# EAGLE design AMP 1.0 (EAGLE 6.5.0)
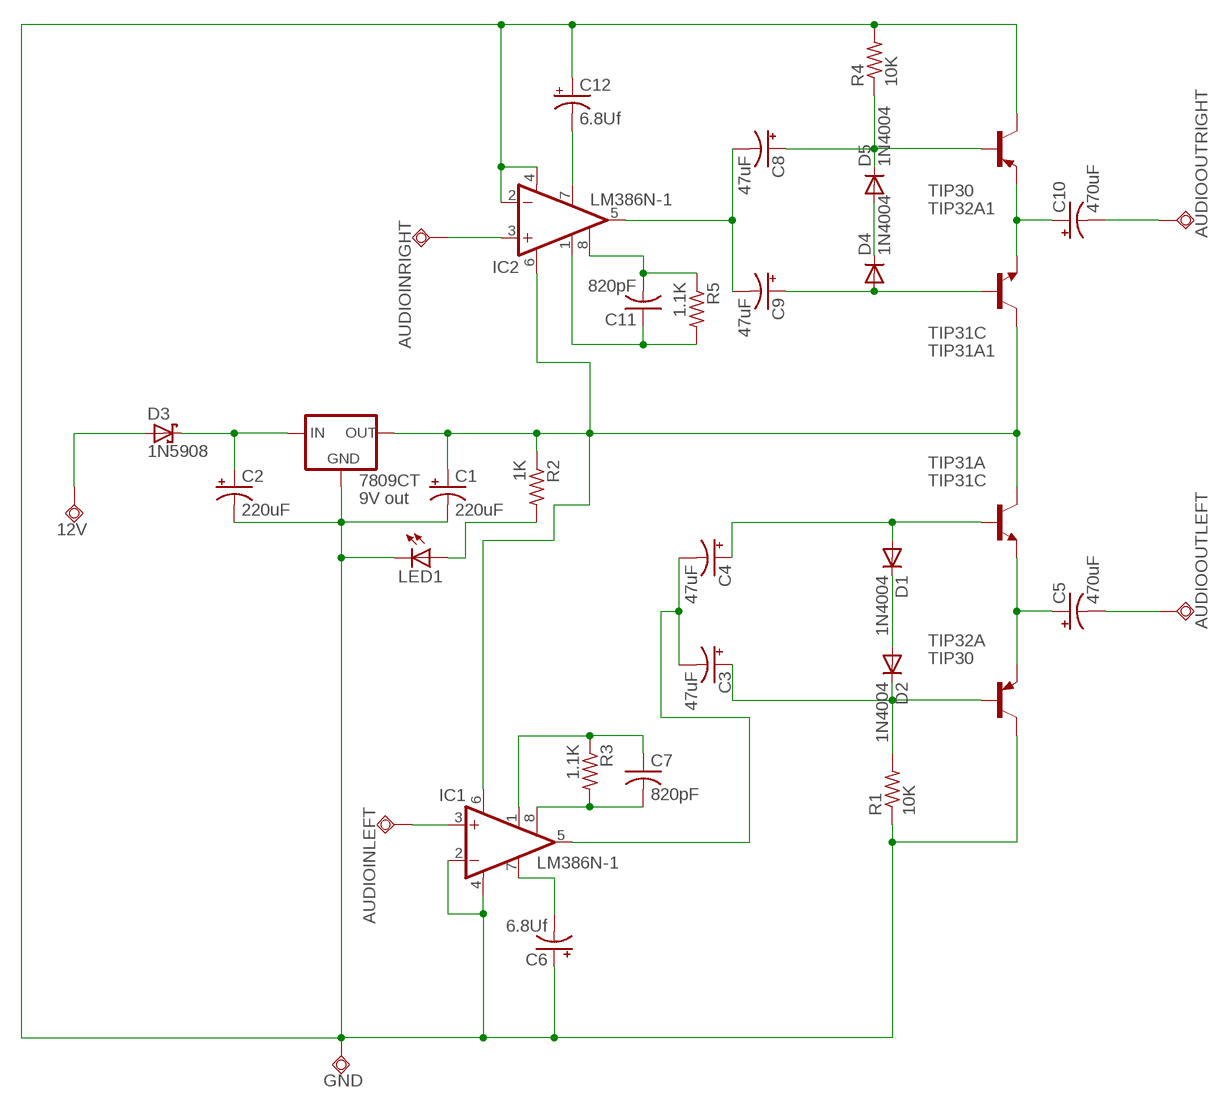
[diagram p0: schematic, sheet 1]

## Parts
12V  TPSQPAD1-20  [P1-20]
7809CT  9V out  78XXL  [78XXL]
AUDIOINLEFT  TPSQPAD1-20  [P1-20]
AUDIOINRIGHT  TPSQPAD1-20  [P1-20]
AUDIOOUTLEFT  TPSQPAD1-20  [P1-20]
AUDIOOUTRIGHT  TPSQPAD1-20  [P1-20]
C1  220uF  CPOL-USB45181C  [B45181C]
C2  220uF  CPOL-USB45181C  [B45181C]
C3  47uF  CPOL-USE5-4  [E5-4]
C4  47uF  CPOL-USE5-4  [E5-4]
C5  470uF  CPOL-USE5-4  [E5-4]
C6  6.8Uf  CPOL-USE5-4  [E5-4]
C7  820pF  C-US050-050X075  [C050-050X075]
C8  47uF  CPOL-USE5-4  [E5-4]
C9  47uF  CPOL-USE5-4  [E5-4]
C10  470uF  CPOL-USE5-4  [E5-4]
C11  820pF  C-US050-050X075  [C050-050X075]
C12  6.8Uf  CPOL-USE5-4  [E5-4]
D1  1N4004  [DO41-10]
D2  1N4004  [DO41-10]
D3  1N5908  [C4111-15]
D4  1N4004  [DO41-10]
D5  1N4004  [DO41-10]
GND  TPSQPAD1-20  [P1-20]
IC1  LM386N-1  [DIL08]
IC2  LM386N-1  [DIL08]
LED1  LED5MM  [LED5MM]
R1  10K  R-US_0204/7  [0204/7]
R2  1K  R-US_0204/7  [0204/7]
R3  1.1K  R-US_0204/7  [0204/7]
R4  10K  R-US_0204/7  [0204/7]
R5  1.1K  R-US_0204/7  [0204/7]
TIP31A  TIP31C  [TO220]
TIP31A1  TIP31C  [TO220]
TIP32A  TIP30  [TO220]
TIP32A1  TIP30  [TO220]

## Nets
N$1: D1.C D2.A
N$2: C3.+ D2.C R1.2 TIP32A.1(B)
N$3: C4.+ D1.A TIP31A.1(B)
N$4: C5.+ TIP31A.3(E) TIP32A.3(E)
N$5: AUDIOOUTLEFT.TP C5.-
N$6: 7809CT.IN C2.+ D3.C
N$7: AUDIOINLEFT.TP IC1.3(+IN)
N$8: 7809CT.OUT C1.+ IC1.6(VS) IC2.6(VS) R2.1 TIP31A1.2(C) TIP31A.2(C)
N$9: C3.- C4.- IC1.5(OUT)
N$10: LED1.A R2.2
N$11: 12V.TP D3.A
N$12: C6.- IC1.7(BYPASS)
N$13: C7.2 IC1.8(GAIN) R3.2
N$14: AUDIOINRIGHT.TP IC2.3(+IN)
N$15: C7.1 IC1.1(GAIN) R3.1
N$16: C10.+ TIP31A1.3(E) TIP32A1.3(E)
N$17: C8.+ D5.C R4.1 TIP32A1.1(B)
N$18: C9.+ D4.A TIP31A1.1(B)
N$19: D4.C D5.A
N$20: AUDIOOUTRIGHT.TP C10.-
N$21: C8.- C9.- IC2.5(OUT)
N$23: 7809CT.GND C1.- C2.- C6.+ C12.+ GND.TP IC1.2(-IN) IC1.4(GND) IC2.2(-IN) IC2.4(GND) LED1.K(C) R1.1 R4.2 TIP32A1.2(C) TIP32A.2(C)
N$25: C11.2 IC2.8(GAIN) R5.1
N$26: C11.1 IC2.1(GAIN) R5.2
N$27: C12.- IC2.7(BYPASS)

## Library data of the parts
12V AUDIOINLEFT AUDIOINRIGHT AUDIOOUTLEFT AUDIOOUTRIGHT GND = testpad:TPSQ: Test pad
7809CT = v-reg:78XXL: VOLTAGE REGULATOR
C1-C6 C8-C10 C12 = rcl:CPOL-US: POLARIZED CAPACITOR, American symbol
C7 C11 = rcl:C-US: CAPACITOR, American symbol
D1 D2 D4 D5 = diode:1N4004: DIODE general purpose rectifier, 1 A
D3 = diode:1N5908: DIODE schottky
IC1 IC2 = linear:LM386?-*: Low Voltage Audio Power Amplifier Source: http://cache.national.com/ds/LM/LM386.pdf
LED1 = led:LED: LED OSRAM: - CHIPLED LG R971, LG N971, LY N971, LG Q971, LY Q971, LO R971, LY R971 LH N974, LH R974 LS Q976, LO Q976, LY Q976 LO Q996 - Hyper CHIPLED LW Q18S LB Q993, LB Q99A, LB R99A - SideLED LS A670, LO A670, LY A670, LG A670, LP A670 LB A673, LV A673, LT A673, LW A673 LH A674 LY A675 LS A676, LA A676, LO A676, LY A676, LW A676 LS A679, LY A679, LG A679 - Hyper Micro SIDELED® LS Y876, LA Y876, LO Y876, LY Y876 LT Y87S - SmartLED LW L88C, LW L88S LB L89C, LB L89S, LG L890 LS L89K, LO L89K, LY L89K LS L896, LA L896, LO L896, LY L896 - TOPLED LS T670, LO T670, LY T670, LG T670, LP T670 LSG T670, LSP T670, LSY T670, LOP T670, LYG T670 LG T671, LOG T671, LSG T671 LB T673, LV T673, LT T673, LW T673 LH T674 LS T676, LA T676, LO T676, LY T676, LB T676, LH T676, LSB T676, LW T676 LB T67C, LV T67C, LT T67C, LS T67K, LO T67K, LY T67K, LW E67C LS E67B, LA E67B, LO E67B, LY E67B, LB E67C, LV E67C, LT E67C LW T67C LS T679, LY T679, LG T679 LS T770, LO T770, LY T770, LG T770, LP T770 LB T773, LV T773, LT T773, LW T773 LH T774 LS E675, LA E675, LY E675, LS T675 LS T776, LA T776, LO T776, LY T776, LB T776 LHGB T686 LT T68C, LB T68C - Hyper Mini TOPLED® LB M676 - Mini TOPLED Santana® LG M470 LS M47K, LO M47K, LY M47K Source: http://www.osram.convergy.de LUXEON: - LUMILED® LXK2-PW12-R00, LXK2-PW12-S00, LXK2-PW14-U00, LXK2-PW14-V00 LXK2-PM12-R00, LXK2-PM12-S00, LXK2-PM14-U00 LXK2-PE12-Q00, LXK2-PE12-R00, LXK2-PE12-S00, LXK2-PE14-T00, LXK2-PE14-U00 LXK2-PB12-K00, LXK2-PB12-L00, LXK2-PB12-M00, LXK2-PB14-N00, LXK2-PB14-P00, LXK2-PB14-Q00 LXK2-PR12-L00, LXK2-PR12-M00, LXK2-PR14-Q00, LXK2-PR14-R00 LXK2-PD12-Q00, LXK2-PD12-R00, LXK2-PD12-S00 LXK2-PH12-R00, LXK2-PH12-S00 LXK2-PL12-P00, LXK2-PL12-Q00, LXK2-PL12-R00 Source: www.luxeon.com KINGBRIGHT: KA-3528ASYC Source: www.kingbright.com
R1-R5 = rcl:R-US_: RESISTOR, American symbol
TIP31A TIP31A1 = transistor-npn:TIP31C*: NPN Transistor
TIP32A TIP32A1 = transistor-pnp:TIP30: PNP Transistor

## Board
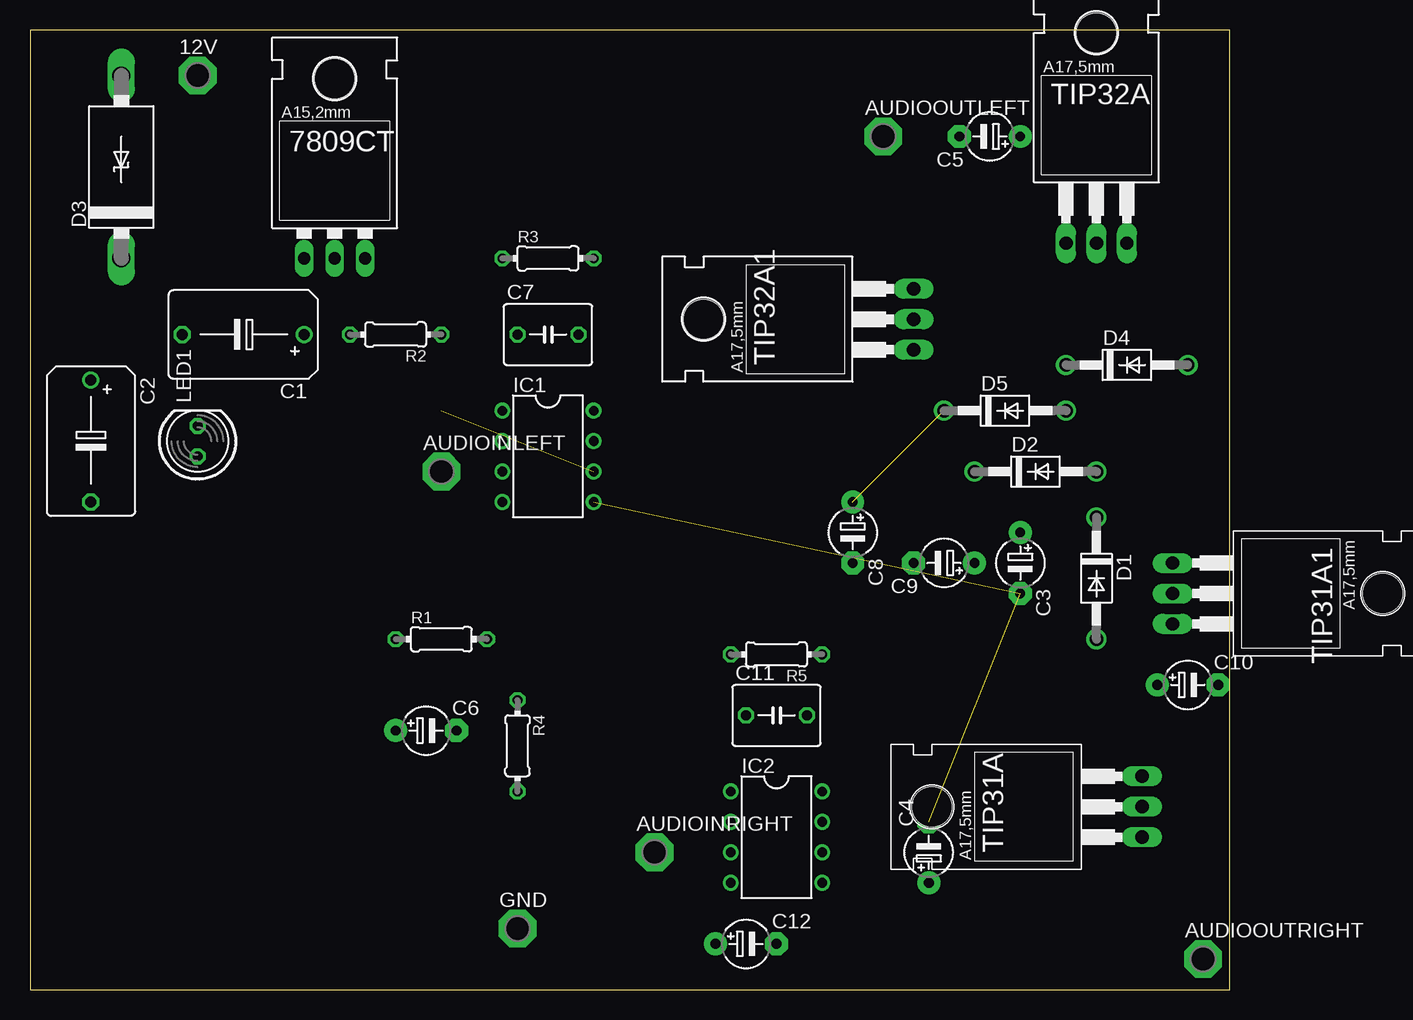
[diagram p1: board, top side]
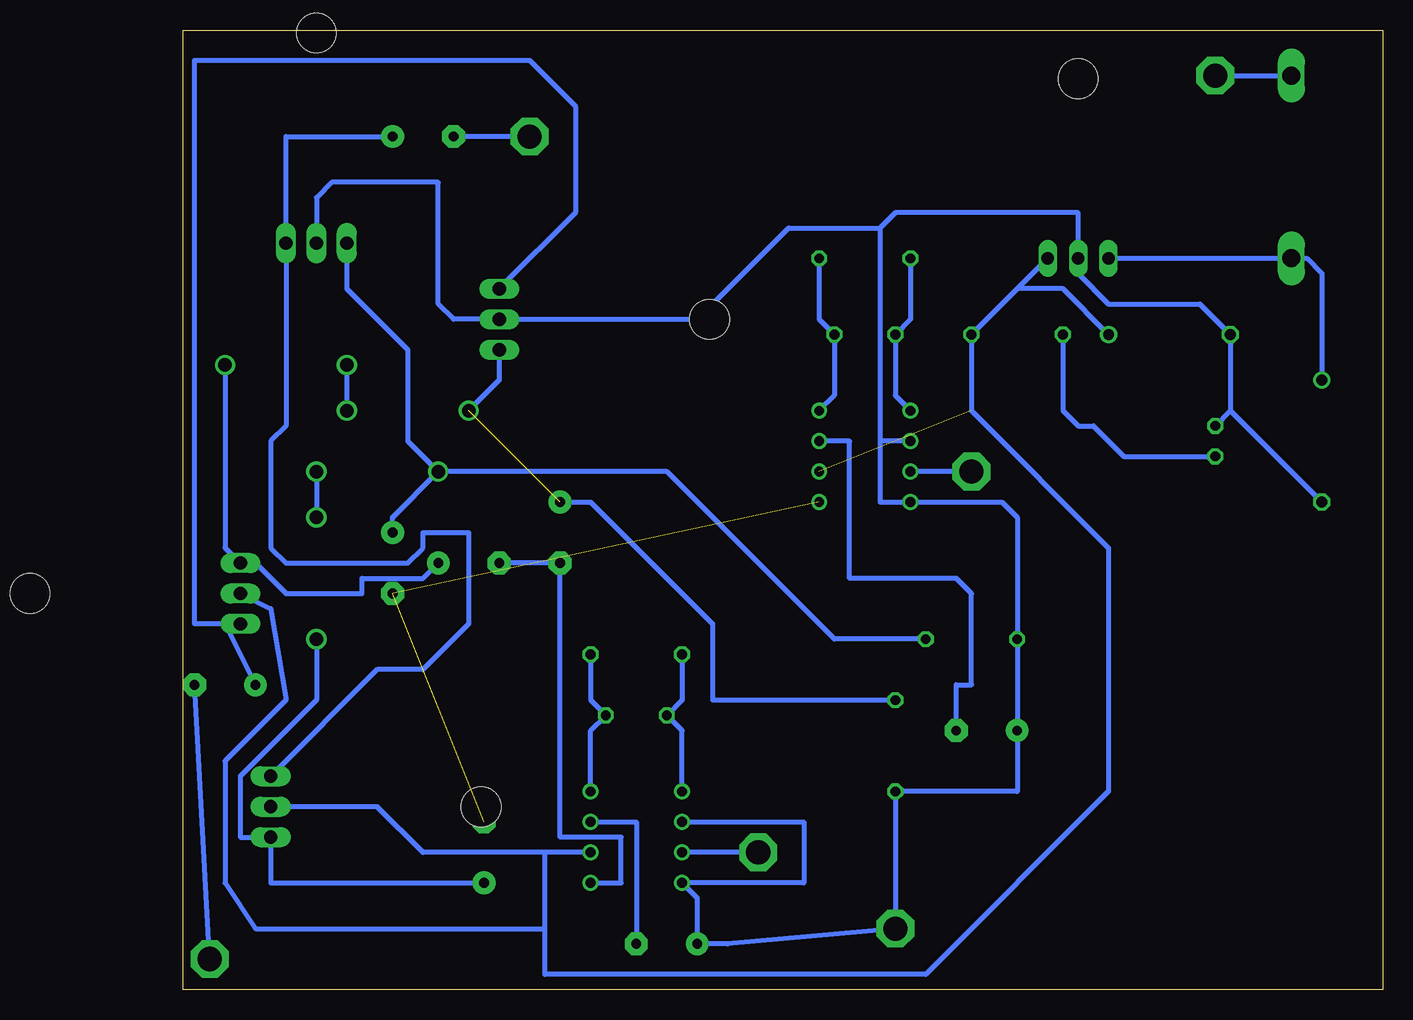
[diagram p2: board, bottom side, seen from below]

Size 100 x 80 mm. Coordinates in mm from the lower left corner, seen from the top.
Outline: 0,0 100,0 100,80 0,80 0,0
Copper layers (1*16): Top 0.035mm / dielectric 1.5mm / Bottom 0.035mm
Design rules "default": minimum track width 10mil, minimum drill 24mil, track to track 8mil, track to pad 8mil, pad to pad 8mil, via to via 8mil, smd to smd 8mil, copper to edge 40mil, drill to drill 8mil, minimum pad ring 10mil, minimum via ring 8mil, stop-mask expansion 4mil, vias tented up to drill 0mil, thermal gap 10mil

### Footprints (pad centres in the part's own frame; a part is rotated, then mirrored left to right if it is on the bottom)
P1-20 = drill 2.007 pad 3.15 octagon: TP 0,0
78XXL = drill 1.016 long: GND 0,-3.81; IN -2.54,-3.81; OUT 2.54,-3.81 | hole 3.302: 0,11.176
B45181C = drill 0.914: + -5.08,0 | drill 0.914 octagon: - 5.08,0
E5-4 = drill 0.813 pad 1.905: + -2.54,0 | drill 0.813 pad 1.905 octagon: - 2.54,0
C050-050X075 = drill 0.813 octagon: 1 -2.54,0; 2 2.54,0
DO41-10 = drill 1.118: A 5.08,0; C -5.08,0
C4111-15 = drill 1.499 long: A 7.62,0; C -7.62,0
DIL08 = drill 0.813 pad 1.27: 1 -3.81,-3.81; 2 -1.27,-3.81; 3 1.27,-3.81; 4 3.81,-3.81; 5 3.81,3.81; 6 1.27,3.81; 7 -1.27,3.81; 8 -3.81,3.81
LED5MM = drill 0.813 octagon: A -1.27,0; K 1.27,0
0204/7 = drill 0.813 octagon: 1 -3.81,0; 2 3.81,0
TO220 = drill 1.118 long: 1 -2.54,-6.35; 2 0,-6.35; 3 2.54,-6.35 | hole 3.302: 0,11.176

### Placement (x,y rotation side)
12V  13.97,76.2 0 top
7809CT  25.4,64.77 0 top
AUDIOINLEFT  34.29,43.18 0 top
AUDIOINRIGHT  52.07,11.43 0 top
AUDIOOUTLEFT  71.12,71.12 0 top
AUDIOOUTRIGHT  97.79,2.54 0 top
C1  17.78,54.61 180 top
C2  5.08,45.72 270 top
C3  82.55,35.56 270 top
C4  74.93,11.43 90 top
C5  80.01,71.12 180 top
C6  33.02,21.59 0 top
C7  43.18,54.61 0 top
C8  68.58,38.1 270 top
C9  76.2,35.56 180 top
C10  96.52,25.4 0 top
C11  62.23,22.86 0 top
C12  59.69,3.81 0 top
D1  88.9,34.29 270 top
D2  83.82,43.18 0 top
D3  7.62,68.58 90 top
D4  91.44,52.07 0 top
D5  81.28,48.26 0 top
GND  40.64,5.08 0 top
IC1  43.18,44.45 270 top
IC2  62.23,12.7 270 top
LED1  13.97,45.72 90 top
R1  34.29,29.21 0 top
R2  30.48,54.61 180 top
R3  43.18,60.96 0 top
R4  40.64,20.32 270 top
R5  62.23,27.94 180 top
TIP31A  86.36,15.24 90 top
TIP31A1  101.6,33.02 270 top
TIP32A  88.9,68.58 0 top
TIP32A1  67.31,55.88 90 top

### Tracks (layer width: path | path; a pad name or v marks a point on that pad's centre or on a via)
N$1
  Bottom 0.406: D2.A D1.C
N$2
  Bottom 0.406: R1.2 45.72,29.21 59.69,43.18 D2.C | C3.+ 82.55,39.37 D2.C | TIP32A.1 86.36,58.42 81.28,53.34 81.28,45.72 D2.C
N$3
  Bottom 0.406: D1.A 88.9,24.13 95.25,17.78 95.25,12.7 TIP31A.1 92.71,8.89 C4.+
N$4
  Bottom 0.406: C5.+ 91.44,71.12 TIP32A.3 91.44,46.99 92.71,45.72 92.71,36.83 91.44,35.56 81.28,35.56 80.01,36.83 80.01,38.1 76.2,38.1 76.2,30.48 80.01,26.67 83.82,26.67 TIP31A.3
N$5
  Bottom 0.406: AUDIOOUTLEFT.TP C5.-
N$6
  Bottom 0.406: C2.+ 5.08,59.69 6.35,60.96 D3.C 7809CT.IN
N$7
  Bottom 0.406: AUDIOINLEFT.TP IC1.3
N$8  (1 unrouted)
  Bottom 0.406: 30.48,58.42 R2.1 34.29,48.26 22.86,36.83 22.86,16.51 38.1,1.27 69.85,1.27 69.85,5.08 | 30.48,58.42 7809CT.OUT | C1.+ 26.67,58.42 30.48,58.42 | IC2.6 69.85,11.43 | 69.85,11.43 80.01,11.43 83.82,15.24 TIP31A.2 | 69.85,5.08 69.85,11.43 | TIP31A1.2 92.71,31.75 91.44,24.13 96.52,19.05 96.52,8.89 93.98,5.08 69.85,5.08
N$9  (2 unrouted)
N$10
  Bottom 0.406: R2.2 26.67,48.26 25.4,46.99 24.13,46.99 21.59,44.45 LED1.A
N$11
  Bottom 0.406: 12V.TP D3.A
N$12
  Bottom 0.406: C6.- 35.56,25.4 34.29,25.4 34.29,33.02 35.56,34.29 44.45,34.29 44.45,45.72 IC1.7
N$13
  Bottom 0.406: R3.2 46.99,55.88 C7.2 45.72,49.53 IC1.8
N$14
  Bottom 0.406: AUDIOINRIGHT.TP IC2.3
N$15
  Bottom 0.406: R3.1 39.37,55.88 C7.1 40.64,49.53 IC1.1
N$16
  Bottom 0.406: C10.+ 96.52,30.48 TIP31A1.3 99.06,30.48 99.06,77.47 71.12,77.47 67.31,73.66 67.31,64.77 TIP32A1.3
N$17  (1 unrouted)
  Bottom 0.406: TIP32A1.1 73.66,50.8 D5.C | R4.1 55.88,24.13 55.88,30.48 66.04,40.64 C8.+
N$18
  Bottom 0.406: D4.A 96.52,36.83 TIP31A1.1 93.98,35.56 91.44,33.02 85.09,33.02 85.09,34.29 80.01,34.29 C9.+
N$19
  Bottom 0.406: D4.C D5.A
N$20
  Bottom 0.406: AUDIOOUTRIGHT.TP C10.-
N$21
  Bottom 0.406: C9.- C8.- 68.58,12.7 63.5,12.7 63.5,8.89 IC2.5
N$23
  Bottom 0.406: 12.7,48.26 C1.- 15.24,57.15 22.86,57.15 25.4,59.69 7809CT.GND 25.4,64.77 40.64,64.77 41.91,63.5 | 12.7,48.26 LED1.K | 12.7,48.26 C2.- | 41.91,63.5 41.91,45.72 | 41.91,45.72 41.91,40.64 IC1.4 31.75,40.64 30.48,39.37 R1.1 C6.+ 30.48,16.51 R4.2 GND.TP 54.61,3.81 C12.+ 57.15,7.62 IC2.4 48.26,8.89 48.26,13.97 IC2.2 | IC1.2 41.91,45.72 | 41.91,63.5 49.53,63.5 57.15,55.88 TIP32A1.2 77.47,55.88 78.74,57.15 78.74,67.31 87.63,67.31 88.9,66.04 TIP32A.2
N$25
  Bottom 0.406: R5.1 66.04,24.13 C11.2 66.04,21.59 IC2.8
N$26
  Bottom 0.406: IC2.1 58.42,21.59 C11.1 58.42,24.13 R5.2
N$27
  Bottom 0.406: IC2.7 62.23,13.97 C12.-